# Altium schematic sheet BLE主板.SchDoc
size A4
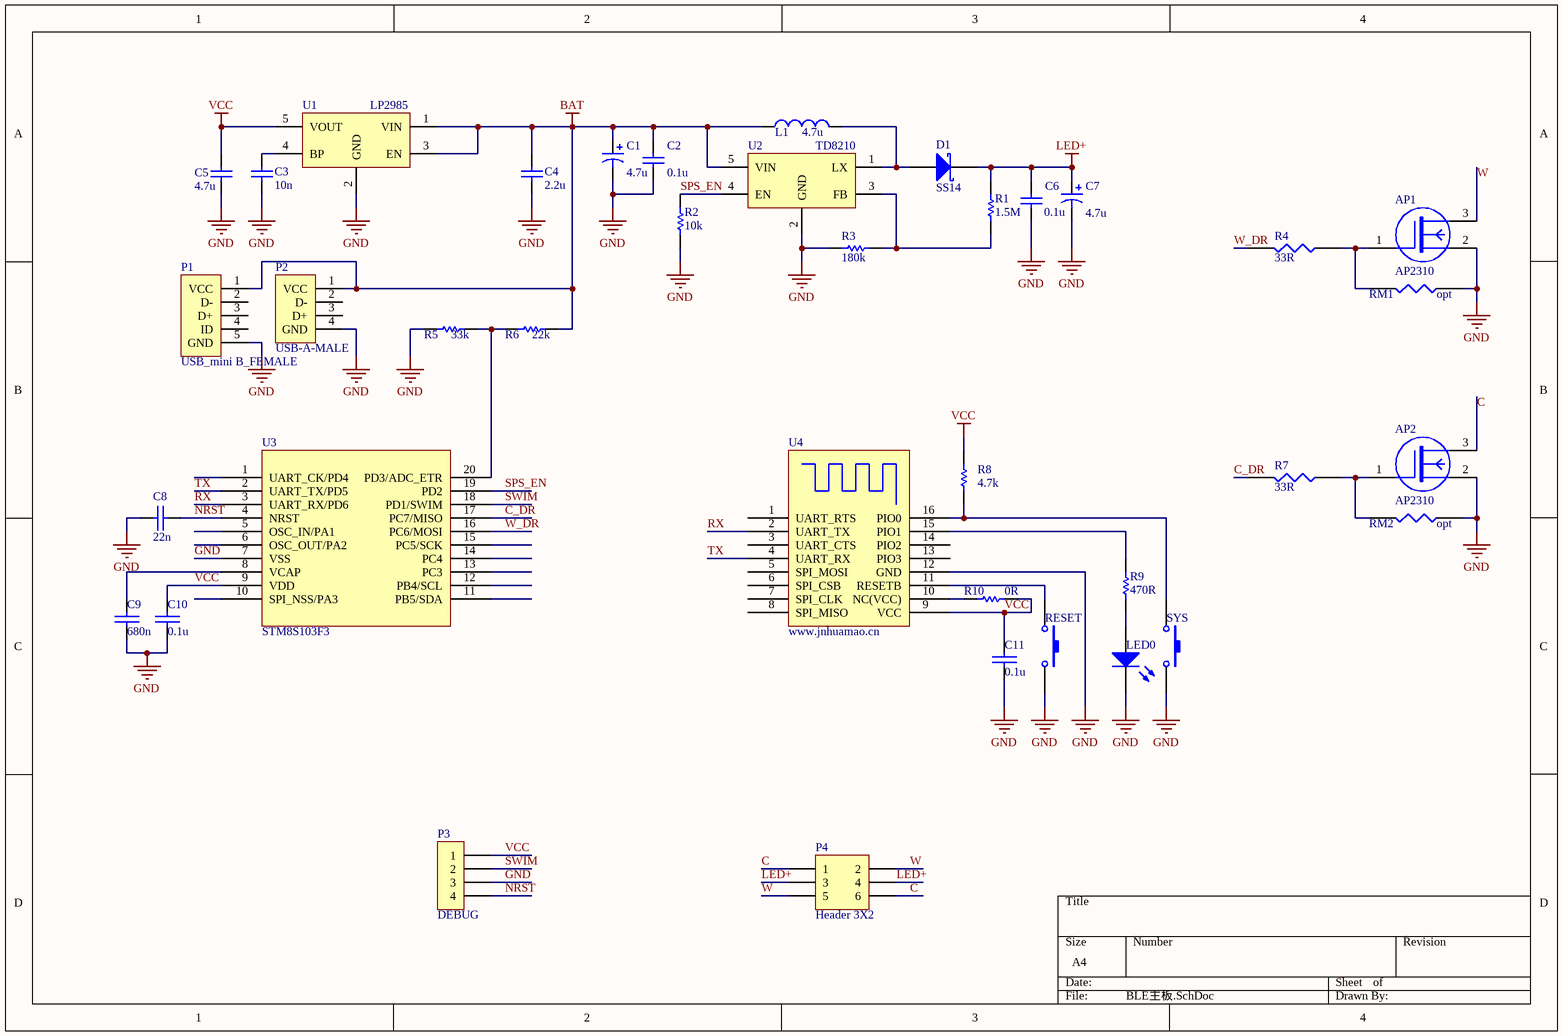
[diagram p0: BLE主板.SchDoc]

## Parts
AP1  AP2310  [SOT23-3N]
AP2  AP2310  [SOT23-3N]
C1  4.7u  [2012[0805]]
C2  0.1u  [2012[0805]]
C3  10n  [2012[0805]]
C4  2.2u  [2012[0805]]
C5  4.7u  [2012[0805]]
C6  0.1u  [2012[0805]]
C7  4.7u  [2012[0805]]
C8  22n  [2012[0805]]
C9  680n  [2012[0805]]
C10  0.1u  [2012[0805]]
C11  0.1u  [2012[0805]]
D1  SS14  [DIOM4227X23N[DO-214AC(SMA)]]
DS1  LED0  [RESC2012N]
L1  4.7u  [INDP7070X40N]
P1  USB_mini B_FEMALE  [USB/SM0.8-6H5]
P2  USB-A-MALE  [USB/SM2.5-4H4]
P3  DEBUG  [HDR1X4]
P4  Header 3X2  [HDR2X3]
R1  1.5M  [2012[0805]]
R2  10k  [2012[0805]]
R3  180k  [2012[0805]]
R4  33R  [2012[0805]]
R5  33k  [2012[0805]]
R6  22k  [2012[0805]]
R7  33R  [2012[0805]]
R8  4.7k  [2012[0805]]
R9  value 470R  [2012[0805]]  (hidden comment: Res1)
R10  0R  [2012[0805]]
RM1  opt  [2012[0805]]
RM2  opt  [2012[0805]]
S1  RESET  [微动开关]
S2  SYS  [微动开关]
U1  LP2985  [SOT23-5AN]
U2  TD8210  [SOT23-5AN]
U3  STM8S103F3  [TSOP65P640-20BN]
U4  www.jnhuamao.cn  [HM_05_06_07_11]

## Nets
BAT: C1.1 C2.1 C4.2 L1.1 P1.1(VCC) P2.1(VCC) R6.2 U1.1(VIN) U1.3(EN) U2.5(VIN)
GND: AP1.2(S) AP2.2(S) C1.2 C2.2 C3.1 C4.1 C5.1 C6.1 C7.2 C8.1 C9.1 C10.1 C11.1 DS1.2(K) P1.5(GND) P2.4(GND) P3.3 R2.1 R3.1 R5.1 RM1.1 RM2.1 S1.2 S2.2 U1.2(GND) U2.2(GND) U3.7(VSS) U4.12(GND)
LED+: C6.2 C7.1 D1.2(K) P4.3 P4.4 R1.2
VCC: C5.2 C10.2 C11.2 P3.1 R8.1 R10.2 U1.5(VOUT) U3.9(VDD) U4.9(VCC)
C: AP2.3(D) P4.1 P4.6
C_DR: R7.2 U3.17(PC7/MISO)
NRST: C8.2 P3.4 U3.4(NRST)
RX: U3.3(UART_RX/PD6) U4.2(UART_TX)
SPS_EN: R2.2 U2.4(EN) U3.19(PD2)
SWIM: P3.2 U3.18(PD1/SWIM)
TX: U3.2(UART_TX/PD5) U4.4(UART_RX)
W: AP1.3(D) P4.2 P4.5
W_DR: R4.2 U3.16(PC6/MOSI)
NetAP1_1: AP1.1(G) R4.1 RM1.2
NetAP2_1: AP2.1(G) R7.1 RM2.2
NetC3_2: C3.2 U1.4(BP)
NetC9_2: C9.2 U3.8(VCAP)
NetD1_1: D1.1(A) L1.2 U2.1(LX)
NetDS1_1: DS1.1(A) R9.2
NetR1_1: R1.1 R3.2 U2.3(FB)
NetR5_2: R5.2 R6.1 U3.20(PD3/ADC_ETR)
NetR8_2: R8.2 S2.1 U4.16(PIO0)
NetR9_1: R9.1 U4.15(PIO1)
NetR10_1: R10.1 U4.10(NC(VCC))
NetS1_1: S1.1 U4.11(RESETB)

Not connected (* = marked no-connect by the designer): P1 2(D-) 3(D+) 4(ID); P2 2(D-) 3(D+); U3 1(UART_CK/PD4) 5(OSC_IN/PA1) 6(OSC_OUT/PA2) 10(SPI_NSS/PA3) 11(PB5/SDA) 12(PB4/SCL) 13(PC3) 14(PC4) 15(PC5/SCK); U4 1(UART_RTS) 3(UART_CTS) 5(SPI_MOSI) 6(SPI_CSB) 7(SPI_CLK) 8(SPI_MISO) 13(PIO3) 14(PIO2)

## Library data of the parts
AP1 AP2 = MOSFET-N1
C1 C7 = Cap Pol1: Polarized Capacitor (Radial); Published: 8-Jun-2000; LatestRevisionDate: 17-Jul-2002; LatestRevisionNote: Re-released for DXP Platform.; PackageReference: RB7.6-15; Publisher: Altium Limited; Value: 4.7u
C2-C6 = Cap: Capacitor; Published: 8-Jun-2000; LatestRevisionDate: 17-Jul-2002; LatestRevisionNote: Re-released for DXP Platform.; PackageReference: RAD-0.3; Publisher: Altium Limited; PackageDescription: Radial Cap, Thru-Hole; 2 Leads; 0.3 in Pin Spacing
  C2 C6: Value: 0.1u
  C3: Value: 10n
  C4: Value: 2.2u
  C5: Value: 4.7u
C8-C11 = CAP: Capacitor
  C8: Value: 22n
  C9: Value: 680n
  C10 C11: Value: 0.1u
D1 = D Schottky: Schottky Diode; Published: 8-Jun-2000; LatestRevisionDate: 17-Jul-2002; LatestRevisionNote: Re-released for DXP Platform.; PackageReference: SMB; Publisher: Altium Limited; PackageDescription: DO-214-AA/SMB; 2 C-Bend Leads; Body 5.3 x 3.6 mm, inc. leads (LxW); Code_JEDEC: DO-214-AA
DS1 = LED0: Typical INFRARED GaAs LED; Published: 8-Jun-2000; Revision: July-2002: Re-released for DXP Platform.; Publisher: Altium Limited
L1 = Inductor: Code_IEC: 1005; Published: 8-Jun-2000; LatestRevisionDate: 29-May-2009; LatestRevisionNote: IPC-7351 Footprint Added.; PackageReference: 0402-A; Publisher: Altium Limited; PackageDescription: Chip Inductor; Code_JEITA: 0402; Value: 4.7u
P1 = Header 5: Header, 5-Pin; LatestRevisionDate: 17-Jul-2002; LatestRevisionNote: Re-released for DXP Platform.; Publisher: Altium Limited
P2 = Header 4: Header, 4-Pin; LatestRevisionDate: 17-Jul-2002; LatestRevisionNote: Re-released for DXP Platform.; Publisher: Altium Limited
P3 = CON4: Connector
P4 = Header 3X2: Header, 3-Pin, Dual row; LatestRevisionDate: 17-Jul-2002; LatestRevisionNote: Re-released for DXP Platform.; Publisher: Altium Limited
R1-R3 R5 R6 R8-R10 = Res1: Resistor; Published: 8-Jun-2000; Publisher: Altium Limited
  R1: LatestRevisionDate: 17-Jul-2002; LatestRevisionNote: Re-released for DXP Platform.; PackageReference: AXIAL-0.3; PackageDescription: Axial Device, Thru-Hole; 2 Leads; 0.3 in Pin Spacing; Value: 1.5M
  R2: LatestRevisionDate: 17-Jul-2002; LatestRevisionNote: Re-released for DXP Platform.; PackageReference: AXIAL-0.3; PackageDescription: Axial Device, Thru-Hole; 2 Leads; 0.3 in Pin Spacing; Value: 10k
  R3: LatestRevisionDate: 17-Jul-2002; LatestRevisionNote: Re-released for DXP Platform.; PackageReference: AXIAL-0.3; PackageDescription: Axial Device, Thru-Hole; 2 Leads; 0.3 in Pin Spacing; Value: 180k
  R5: LatestRevisionDate: 17-Jul-2002; LatestRevisionNote: Re-released for DXP Platform.; PackageReference: AXIAL-0.3; PackageDescription: Axial Device, Thru-Hole; 2 Leads; 0.3 in Pin Spacing; Value: 33k
  R6: LatestRevisionDate: 17-Jul-2002; LatestRevisionNote: Re-released for DXP Platform.; PackageReference: AXIAL-0.3; PackageDescription: Axial Device, Thru-Hole; 2 Leads; 0.3 in Pin Spacing; Value: 22k
  R8: Revision: July-2002: Re-released for DXP Platform.; Value: 4.7k
  R9: Revision: July-2002: Re-released for DXP Platform.
  R10: LatestRevisionDate: 17-Jul-2002; LatestRevisionNote: Re-released for DXP Platform.; PackageReference: AXIAL-0.3; Value: 0R
R4 R7 = RES1: Value: 33R
RM1 RM2 = RES1: Value: 47k
S1 S2 = SW-PB: Switch; Published: 24-Mar-1999; Revision: July-2002: Re-released for DXP Platform.; Publisher: Altium Limited
U3 = Component_1
U4 = HM_05_06_07_11: HM bluetooth module HM-05,HM-06,HM-07, HM-11